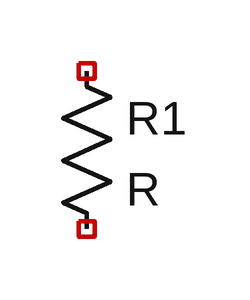
[diagram p0: schematic RTDs.asc]
RTDs.asc, the LTspice schematic file:
Version 4.1
SHEET 1 880 680
SYMBOL res 176 80 R0
SYMATTR InstName R1

The netlist it stands for:
* RTDs.asc
R1 NC_01 NC_02 R
.backanno
.end